# EAGLE schematic pc_healthypi_move_bottom_pcb (EAGLE 9.6.2)
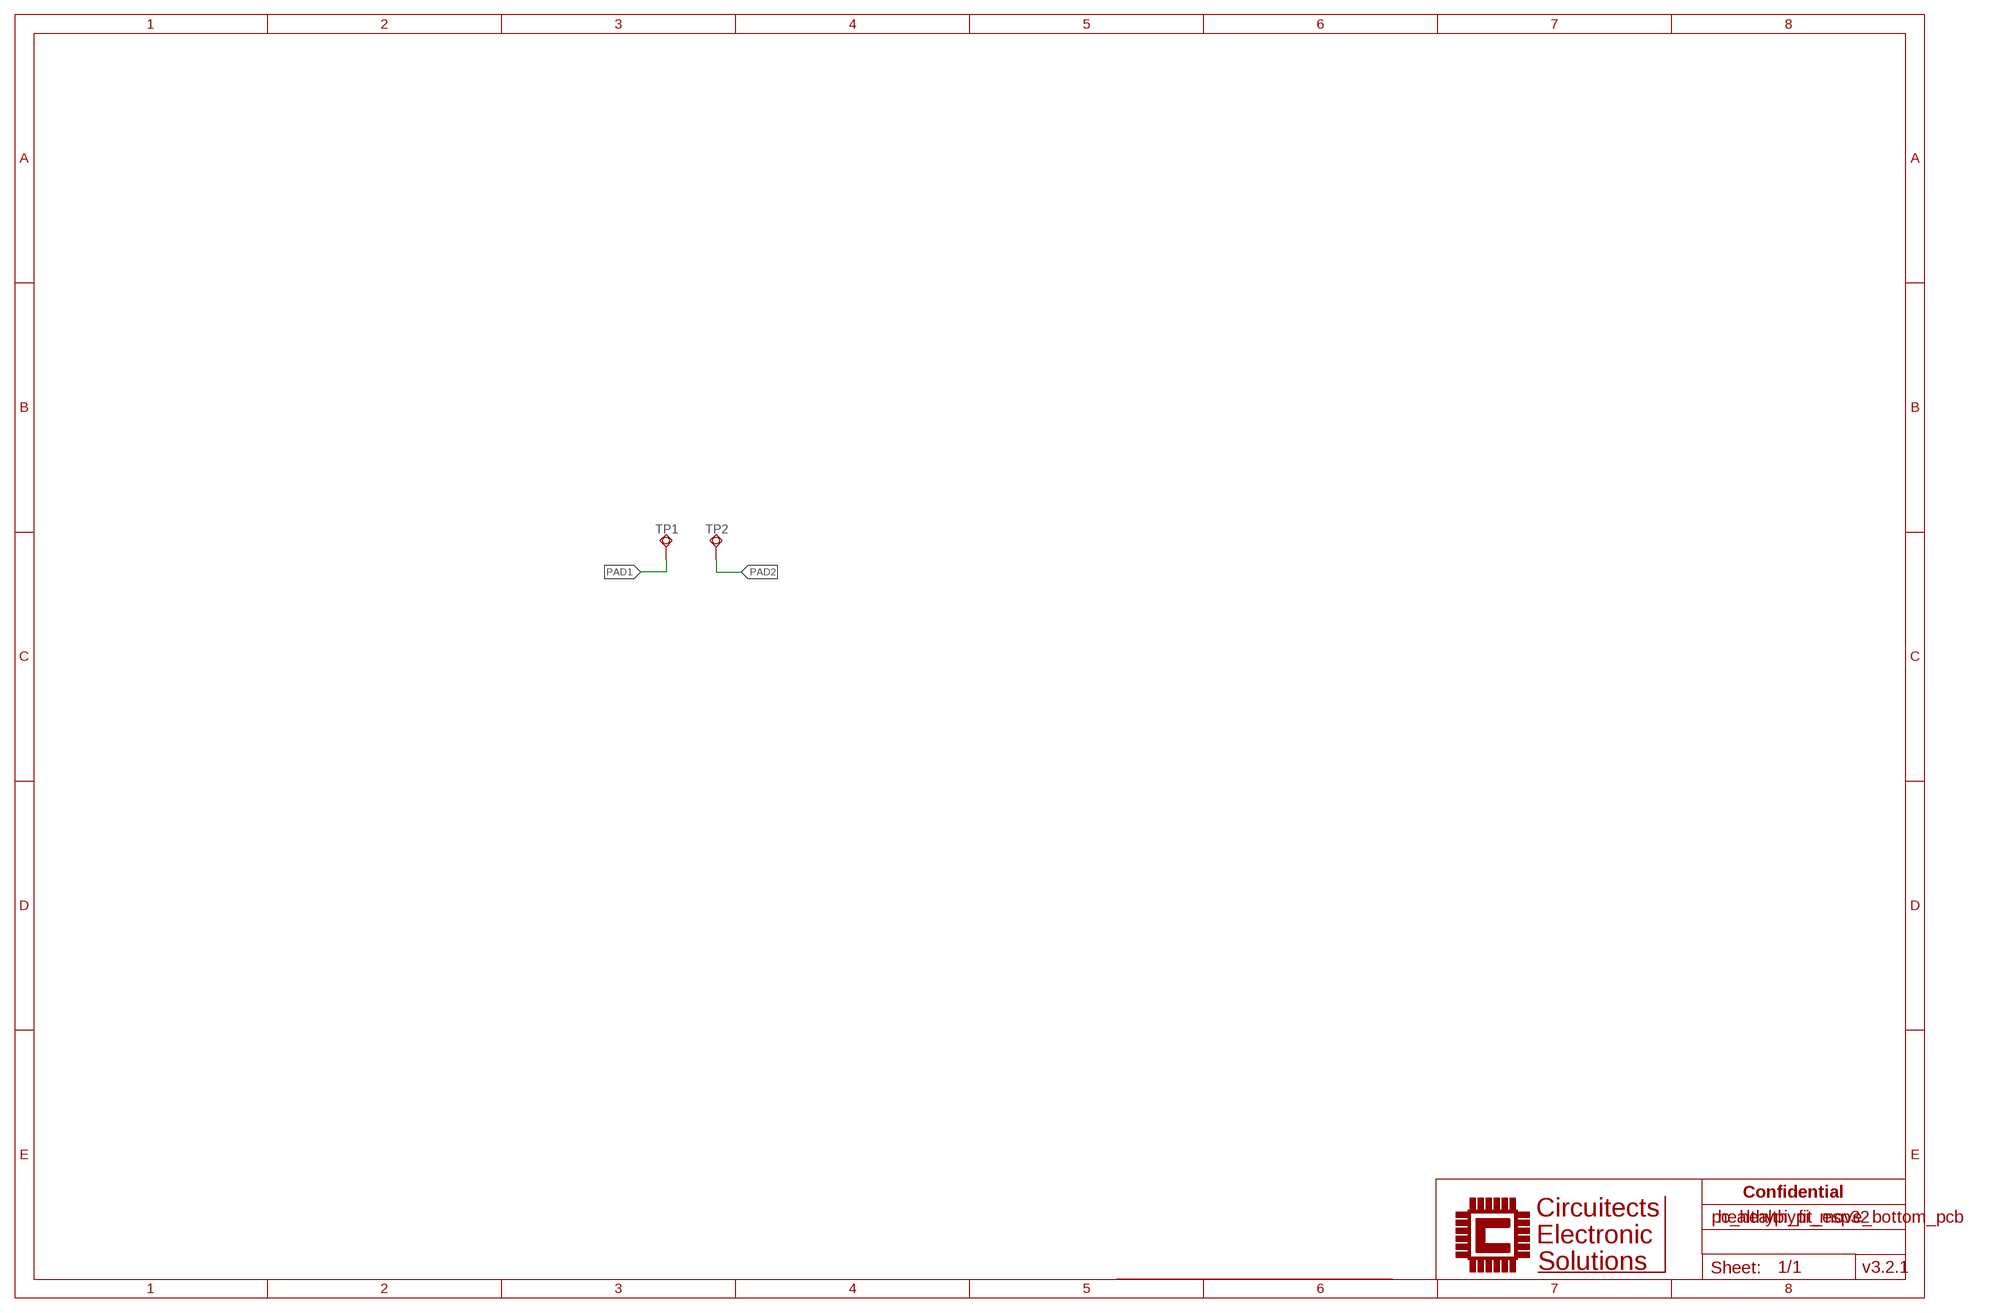
[diagram p0: schematic, sheet 1]

## Parts
TP1  TPSQTP20SQ  [TP20SQ]
TP2  TPSQTP20SQ  [TP20SQ]

## Nets
PAD1: TP1.TP
PAD2: TP2.TP

## Notes on the sheet
- Confidential
- healthypi_fit_esp32
- v3.2.1

## Library data of the parts
TP1 TP2 = testpad:TPSQ: Test pad

## Net classes
2 Clock: width 0.089 mm, clearance 0.178 mm